# Altium schematic sheet gydrodrive_i2c.SchDoc
size 297 x 209 mm; SheetNumber: 17; SheetTotal: 22
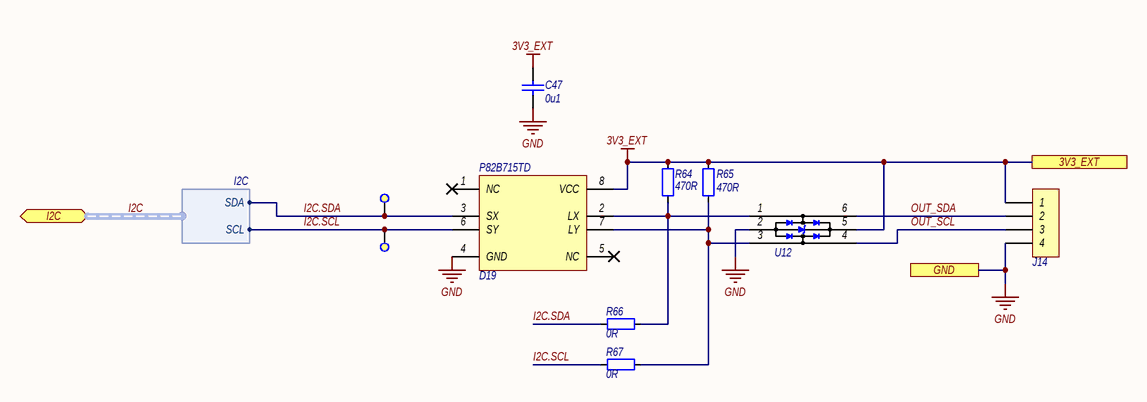
[diagram p0: gydrodrive_i2c.SchDoc]

## Parts
C47  Capacitance: 0u1  [CAPC2012-0805M]  (hidden comment: CAP_0805)
D19  P82B715TD  [SO8_M]
J14  DG142V-5.08-04P  [DG142V-5.08-04P]  (value not drawn)
R64  Resistance: 470R  [RESC2012-0805M]  (hidden comment: RES_0805)
R65  Resistance: 470R  [RESC2012-0805M]  (hidden comment: RES_0805)
R66  Resistance: 0R  [RESC2012-0805M]  (hidden comment: RES_0805)
R67  Resistance: 0R  [RESC2012-0805M]  (hidden comment: RES_0805)
TP16  Test point 1  [TP_1]  (value not drawn)  (no BOM)
TP17  Test point 1  [TP_1]  (value not drawn)  (no BOM)
U12  USBLC6-2SC6  [SOT23-6AM]  (value not drawn)

## Ports
3V3_EXT (see gydrodrive_interfaces[3A], gydrodrive_reservedPins[2B], gydrodrive_supply[3B], gydrodrive_uart[2B]), GND (see gydrodrive_interfaces[3A], gydrodrive_button[2C], gydrodrive_can[2C], gydrodrive_control[2C], gydrodrive_currentSource[1B], gydrodrive_debugger[3C], gydrodrive_discreteControl[2B], gydrodrive_encoder[1B], gydrodrive_indication[3C], gydrodrive_inputTrim[2C], gydrodrive_interfaces[3A], gydrodrive_linearPosSensor[2C], gydrodrive_mcu[6D], gydrodrive_reservedPins[2C], gydrodrive_rs485[2B], gydrodrive_sensor[2C], gydrodrive_sensors[1B], gydrodrive_sto[2C], gydrodrive_supply[2C], gydrodrive_uart[2C]), I2C (bidir, harness I2C, see gydrodrive_interfaces[4A], gydrodrive_mcu[1B])

## Harnesses
I2C: SDA, SCL

## Nets
3V3_EXT: C47.1 D19.8(VCC) J14.1 R64.2 R65.2 U12.5(Vbus) ; port 3V3_EXT
GND: C47.2 D19.4(GND) J14.4 U12.2(GND) ; port GND
I2C.SCL: D19.6(SY) R67.1 TP17.1 ; port I2C.SCL
I2C.SDA: D19.3(SX) R66.1 TP16.1 ; port I2C.SDA
OUT_SCL: J14.3 U12.4(IO2)
OUT_SDA: J14.2 U12.6(IO1)
NetD19_2: D19.2(LX) R64.1 R66.2 U12.1(IO1)
NetD19_7: D19.7(LY) R65.1 R67.2 U12.3(IO2)

Not connected (* = marked no-connect by the designer): D19 1(NC)* 5(NC)*

## Buses and harness runs
harness I2C = port I2C

## Notes on the sheet
- Подп. и дата
- Инв. № дубл.
- Взам. инв. №
- Инв. № подл.
- Изм.
- Лист
- № докум.
- Подп.
- Дата
- Копировал
- Формат
- A4

## Library data of the parts
C47 = CAPC_0805: Конденсатор керамический, корпус 0805; Parameters: 0u1,  50V; Voltage: 50V; Max Price: 5; Part Number: CAPC_0805; Part Name: ='Конд-р керам. 0805,  '  + Parameters; Component Type: Standart; Pin Count: 2
D19 = P82B715TD: Расширитель порта I2C; Part Name: Микросхема P82B715TD; Max Price: 300; Part Number: P82B715TD; Component Type: Standart; Parameters: I2C
J14 = DG142V-5.08-04P: Клеммник 4-контактный, шаг 5.08 мм; Part Name: Клеммник DG142V-5.08-04P; Parameters: 8А; Max Price: 60; System: Connector; Part Number: DG142V-5.08-04P; Component Type: Standart; Pin Count: 4
R64 R65 = RESC_0805: Рез-р, корпус 0805; Tolerance: 5%; Parameters: 470R, 5%; Max Price: 3; Part Number: RESC_0805; Part Name: ='Рез-р 0805, ' + Parameters; Component Type: Standart
R66 R67 = RESC_0805: Рез-р, корпус 0805; Tolerance: 5%; Parameters: 0R, 5%; Max Price: 3; Part Number: RESC_0805; Part Name: ='Рез-р 0805, ' + Parameters; Component Type: Standart
TP16 TP17 = Test point 1: Тестовый контакт круглый 1 мм; Part Number: Test point 1; Part Name: Тестовый контакт; Component Type: Standart (No BOM)
U12 = USBLC6-2SC6: Диодная сборка для защиты дифференциальной линии; Part Name: Диодная сборка USBLC6-2SC6; Parameters: 5.25V; Max Price: 30; Part Number: USBLC6-2SC6; Component Type: Standart; Pin Count: 6; Voltage: 5.25V